# EasyEDA Pro project ProDoc_Board1_2025-01-29.epro

# Schematic Schematic1
Board Name: Board1; Create Date: 2025-01-25; Page Name: P1; Project Name: Pomodorino Timer; Schematic Name: Schematic1; Update Date: 2025-01-27; Company: EasyEDA.com; Page Size: A4; Version: V1.0
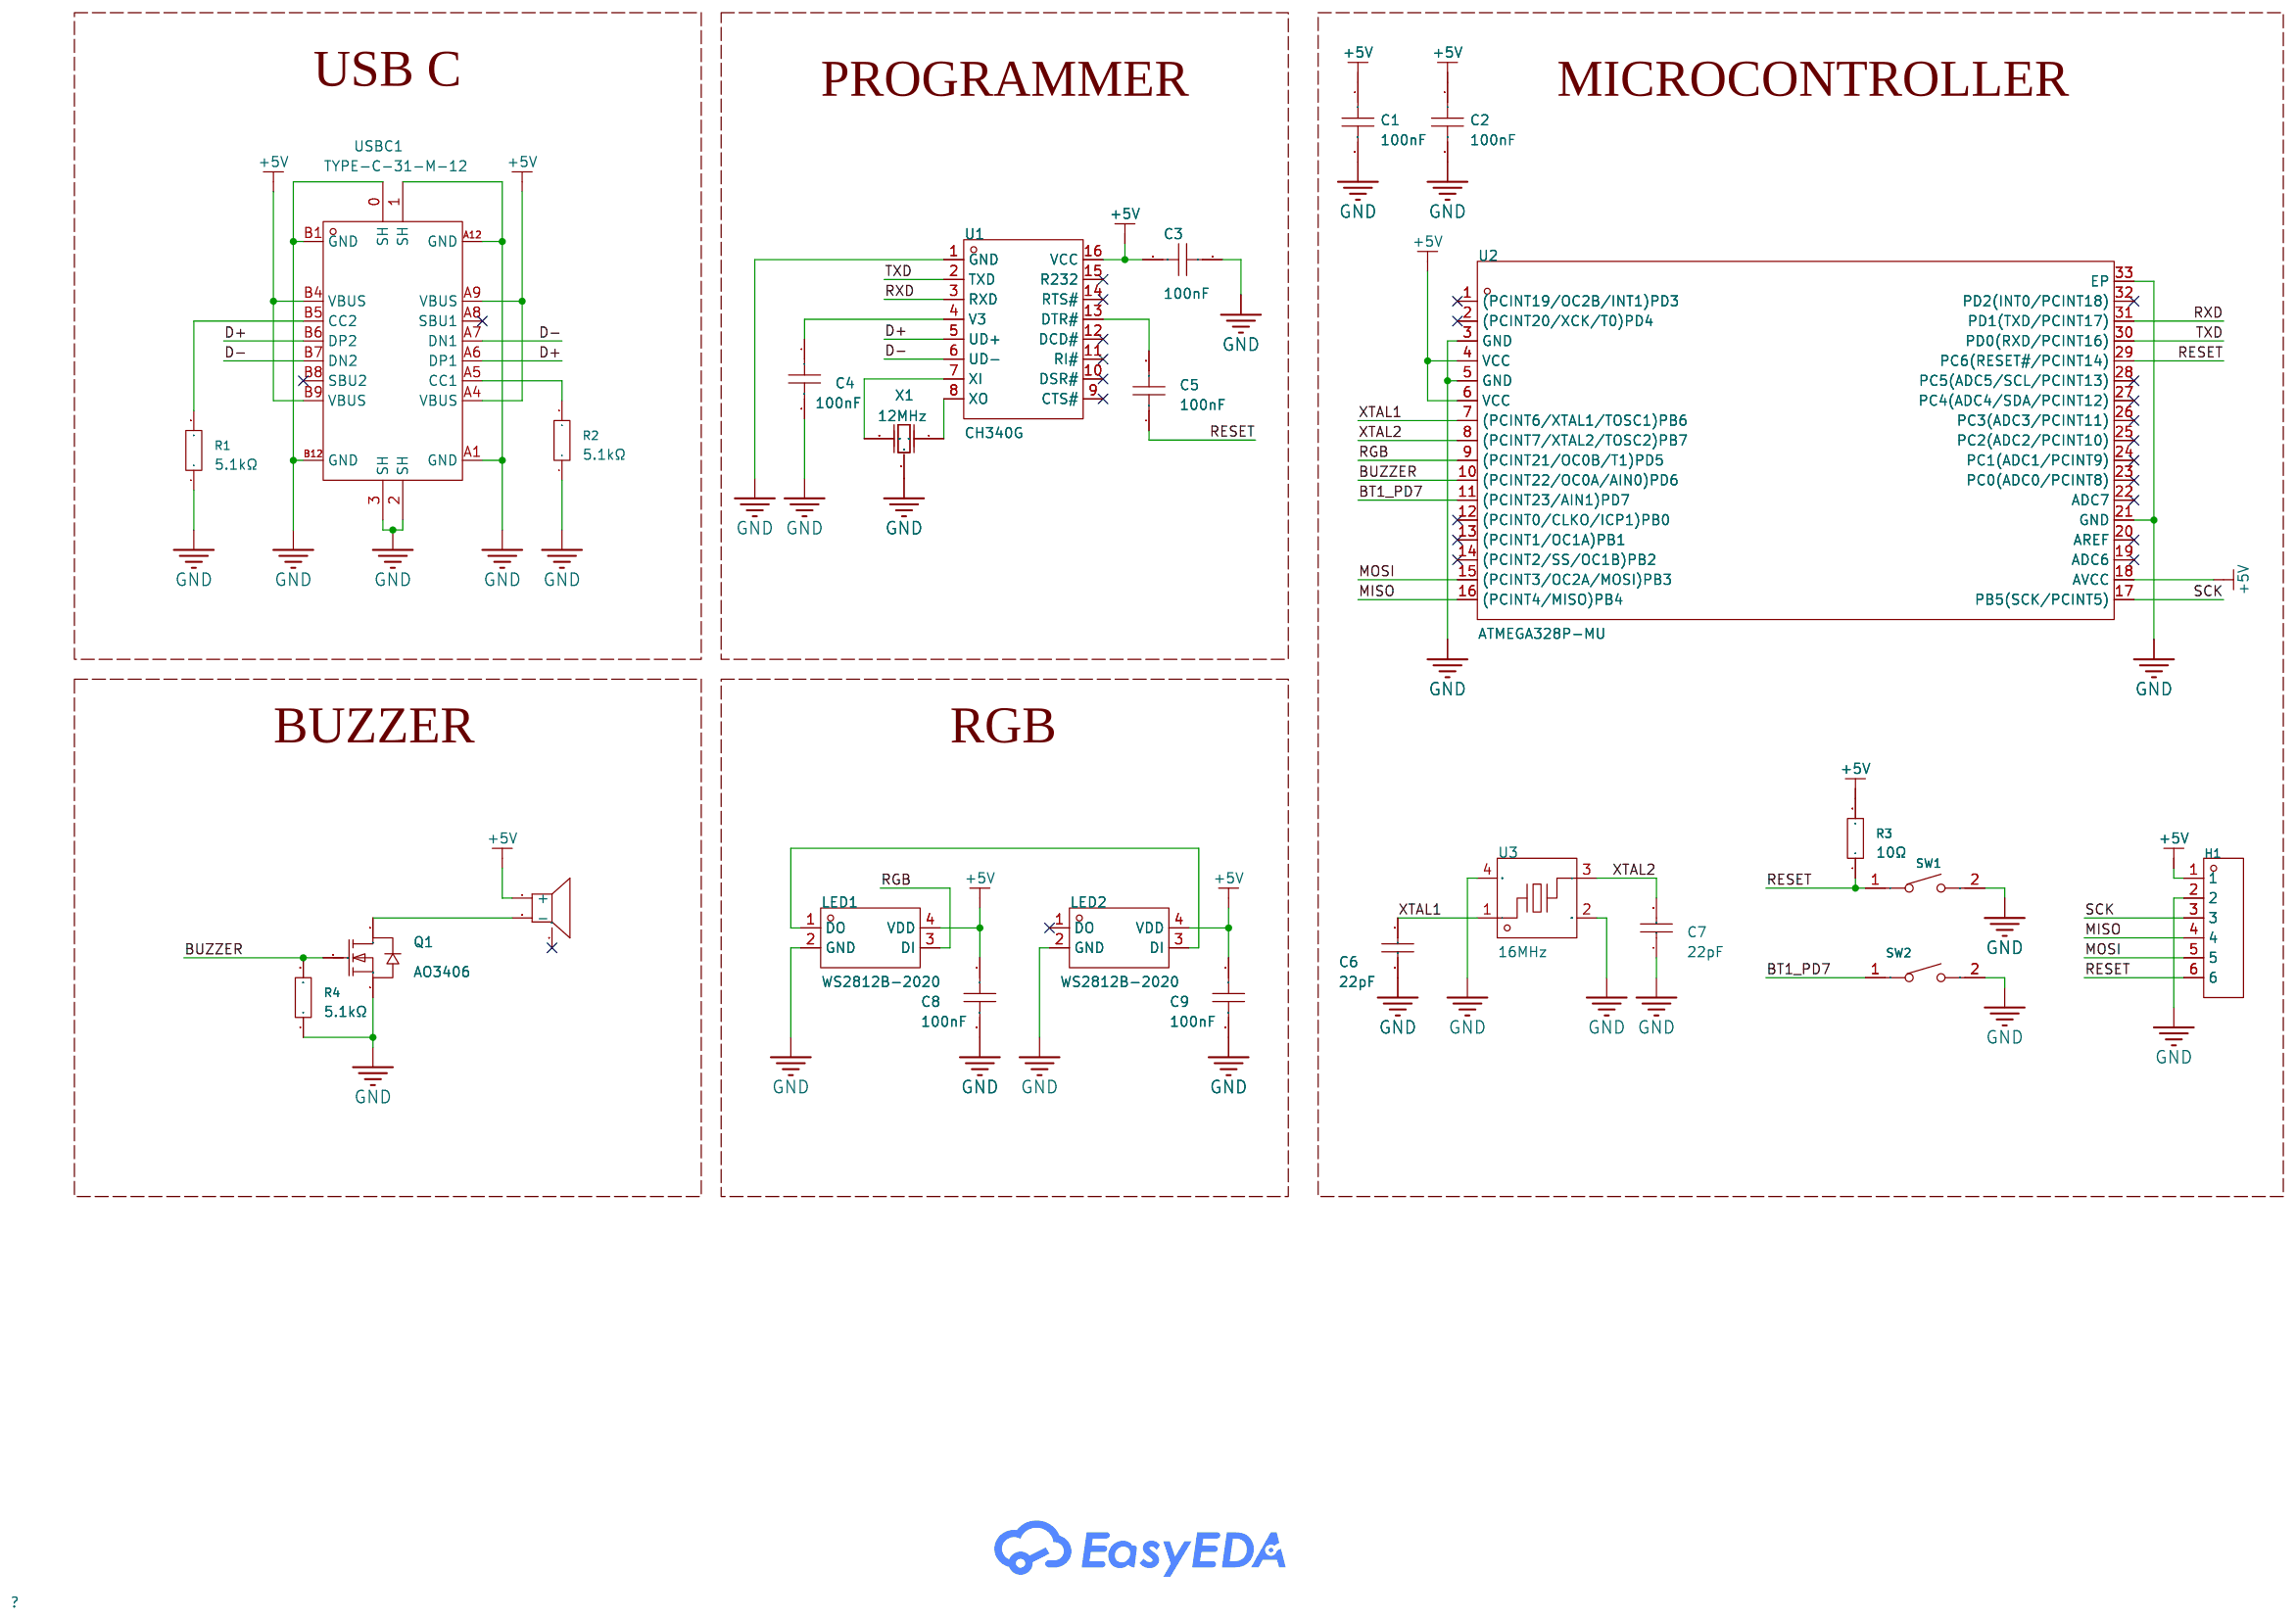
[diagram p0: schematic sheet]

## Parts
BUZZER1  4kHz  [BUZ-SMD_L5.0-W5.5-P4.60]
C1  100nF  [C0402]
C2  100nF  [C0402]
C3  100nF  [C0402]
C4  100nF  [C0402]
C5  100nF  [C0402]
C6  22pF  [C0402]
C7  22pF  [C0402]
C8  100nF  [C0402]
C9  100nF  [C0402]
H1  -  [HDR-TH_6P-P2.54-V-F]
LED1  WS2812B-2020  [LED-SMD_4P-L2.0-W2.0-TL_WS2812B-2020]
LED2  WS2812B-2020  [LED-SMD_4P-L2.0-W2.0-TL_WS2812B-2020]
Q1  AO3406  [SOT-23-3_L2.9-W1.6-P1.90-LS2.8-BR]
R1  5.1kΩ  [R0402]
R2  5.1kΩ  [R0402]
R3  10Ω  [R0402]
R4  5.1kΩ  [R0402]
SW1  TS-1088-AR02016  [SW-SMD_L3.9-W3.0-P4.45]
SW2  TS-1088-AR02016  [SW-SMD_L3.9-W3.0-P4.45]
U1  CH340G  [SOIC-16_L9.9-W3.9-P1.27-LS6.0-BL]
U2  ATMEGA328P-MU  [HVQFN-32_L5.0-W5.0-P0.50-TL-EP3.1]
U3  16MHz  [CRYSTAL-SMD_4P-L3.2-W2.5-BL_SIT8008BI]
USBC1  TYPE-C-31-M-12  [USB-C_SMD-TYPE-C-31-M-12]
X1  12MHz  [CRYSTAL-SMD_3P-L3.2-W1.3-P1.20-L-1]

## Library data of the parts
BUZZER1 = MLT-5020: Driver Circuitry:Passive (external drive) Technology:Electromagnetic Type Frequency:4kHz Length:5.2mm Width:5.2mm Height:2.5mm; Supplier Part: C94598; Manufacturer: 华能; Supplier Footprint: SMD,5x5mm; JLCPCB Part Class: Extended Part; Datasheet: https://atta.szlcsc.com/upload/public/pdf/source/20210811/111454390007D221D7259018FB170E62.pdf; Supplier: LCSC; Driver Circuitry: Passive (external drive); Technology: Electromagnetic Type; Length: 5.2mm; Width: 5.2mm; Height: 2.5mm
C1-C3 C5 C8 C9 = CL05B104KB54PNC: Capacitance: Tolerance:±10% Tolerance:±10% Voltage Rated: Temperature Coefficient:; LCSC Part Name: 100nF ±10% 50V; Supplier Part: C307331; Manufacturer: SAMSUNG(三星); Supplier Footprint: 0402; JLCPCB Part Class: Basic Part; Datasheet: https://atta.szlcsc.com/upload/public/pdf/source/20160218/1457707763339.pdf; Supplier: LCSC; Tolerance: ±10%
C4 = CT41G-0402-2X1-16V-0.1μF-K(N): Capacitance: Tolerance:±10% Tolerance:±10% Voltage Rated: Temperature Coefficient:; LCSC Part Name: 100nF ±10% 16V; Supplier Part: C141382; Manufacturer: TORCH(火炬); Supplier Footprint: 0402; JLCPCB Part Class: Extended Part; Datasheet: https://atta.szlcsc.com/upload/public/pdf/source/20171225/C150708_15141883600121203188.pdf; Supplier: LCSC; Tolerance: ±10%
C6 C7 = 0402CG220J500NT: Capacitance: Tolerance:±5% Tolerance:±5% Voltage Rated: Temperature Coefficient:; LCSC Part Name: 22pF ±5% 50V; Supplier Part: C1555; Manufacturer: FH(风华); Supplier Footprint: 0402; JLCPCB Part Class: Basic Part; Datasheet: https://atta.szlcsc.com/upload/public/pdf/source/20200305/C486355_26A10D38EF8C2A5C37091D0039909270.pdf; Supplier: LCSC; Tolerance: ±5%
H1 = HDR-F_2.54_1x6P: Supplier Footprint: Through
LED1 LED2 = WS2812B-2020: Wavelength:515.6nm；622.5nm；470.4nm Luminous Intensity:- Fixed-Frequency Pwm Mode:- Data Transmission Rate:- Supply Voltage:- Supply Voltage:- Quiescent Dissipation:- Lens Color:-; LCSC Part Name: RGB三色; Supplier Part: C965555; Manufacturer: worldsemi; Supplier Footprint: SMD,2x2mm; JLCPCB Part Class: Extended Part; Datasheet: https://atta.szlcsc.com/upload/public/pdf/source/20241202/DEE3FC25B8AD87F3BB1718ACD77EDECD.pdf; Supplier: LCSC; Wavelength: 515.6nm；622.5nm；470.4nm
Q1 = AO3406_C5379102: Type:1 N-channel Drain Source Voltage (Vdss): Continuous Drain Current (Id): Drain Source On Resistance (RDS(on)@Vgs,Id):35mΩ@10V,3.5A Power Dissipation (Pd):278mW Gate Threshold Voltage (Vgs(th)@Id):1.5V@250uA Total Gate Charge (Qg@Vgs):3.1nC@10V Input C; LCSC Part Name: N沟道,电流:3.5A,耐压:30V; Supplier Part: C5379102; Manufacturer: MSKSEMI(美森科); Supplier Footprint: SOT-23-3L; JLCPCB Part Class: Extended Part; Datasheet: https://atta.szlcsc.com/upload/public/pdf/source/20241113/43B702DEA6BD1B3E76051EAB23BFE352.pdf; Supplier: LCSC; Type: 1 N-channel; Drain Source On Resistance (RDS(on)@Vgs,Id): 35mΩ@10V,3.5A; Power Dissipation (Pd): 278mW; Gate Threshold Voltage (Vgs(th)@Id): 1.5V@250uA; Total Gate Charge (Qg@Vgs): 3.1nC@10V; Input Capacitance (Ciss@Vds): 245pF@25V; Reverse Transfer Capacitance (Crss@Vds): 78pF@25V; Operating Temperature: -50℃~+150℃
R1 R2 R4 = 0402WGF5101TCE: Type:Thick Film Resistors Resistance:5.1kΩ Tolerance:±1% Tolerance:±1% Power(Watts): Overload Voltage (Max): Temperature Coefficient:±100ppm/℃ Temperature Coefficient:±100ppm/℃ Operating Temperature Range:-55℃~+155℃ Operating Temperature Range:-55℃~+155℃; LCSC Part Name: 5.1kΩ ±1% 62.5mW 厚膜电阻; Supplier Part: C25905; Manufacturer: UNI-ROYAL(厚声); Supplier Footprint: 0402; JLCPCB Part Class: Basic Part; Datasheet: https://atta.szlcsc.com/upload/public/pdf/source/20200306/C422600_1E6D84923E4A46A82E41ADD87F860B5C.pdf; Supplier: LCSC; Type: Thick Film Resistors; Tolerance: ±1%; Temperature Coefficient: ±100ppm/℃; Operating Temperature Range: -55℃~+155℃
R3 = 0402WGF100JTCE: Type:Thick Film Resistors Resistance:10Ω Tolerance:±1% Tolerance:±1% Power(Watts): Overload Voltage (Max): Temperature Coefficient:±200ppm/℃ Temperature Coefficient:±200ppm/℃ Operating Temperature Range:-55℃~+155℃ Operating Temperature Range:-55℃~+155℃; LCSC Part Name: 10Ω ±1% 62.5mW 厚膜电阻; Supplier Part: C25077; Manufacturer: UNI-ROYAL(厚声); Supplier Footprint: 0402; JLCPCB Part Class: Basic Part; Datasheet: https://atta.szlcsc.com/upload/public/pdf/source/20200306/C422600_1E6D84923E4A46A82E41ADD87F860B5C.pdf; Supplier: LCSC; Type: Thick Film Resistors; Tolerance: ±1%; Temperature Coefficient: ±200ppm/℃; Operating Temperature Range: -55℃~+155℃
SW1 SW2 = TS-1088-AR02016: Circuit:SPST Actuator Style:Round Button Operating Force:160gf Mounting Style:Brick nogging Switch Length:4mm Switch Width:3mm Switch Height:2mm Strike Gundam:不带 Contact Current:50mA Voltage Rating (DC):12V Insulation Resistance:100MΩ Actuator/Cap Color:B; LCSC Part Name: 4*3*2mm 立贴 轻触开关; Supplier Part: C720477; Manufacturer: XUNPU(讯普); Supplier Footprint: SMD; JLCPCB Part Class: Extended Part; Datasheet: https://atta.szlcsc.com/upload/public/pdf/source/20200810/C720475_60D09DD6C54279ADDB2DC25100F1CC11.pdf; Supplier: LCSC; Circuit: SPST; Actuator Style: Round Button; Operating Force: 160gf; Mounting Style: Brick nogging; Switch Length: 4mm; Switch Width: 3mm; Switch Height: 2mm; Strike Gundam: 不带; Contact Current: 50mA; Voltage Rating (DC): 12V; Insulation Resistance: 100MΩ; Actuator/Cap Color: Black; Pin Style: SMDSplicing; Mechanical Life: 10万次; Operating Temperature: -30℃~+80℃
U1 = CH340G: Applications Function:USB to UART Protocol: Supply Voltage:5V；3.3V Supply Voltage:5V；3.3V Data Rate:2Mbps Operating Temperature:-40℃~+85℃ Operating Temperature:-40℃~+85℃; LCSC Part Name: USB转串口芯片CH340; Supplier Part: C14267; Manufacturer: WCH(南京沁恒); Supplier Footprint: SOP-16; JLCPCB Part Class: Extended Part; Datasheet: https://atta.szlcsc.com/upload/public/pdf/source/20240313/8510303D24D987FBF1AD30058571F10E.pdf; Supplier: LCSC; Applications Function: USB to UART; Supply Voltage: 5V；3.3V; Data Rate: 2Mbps; Operating Temperature: -40℃~+85℃
U2 = ATMEGA328P-MU_C7499261: CPU Core:AVR CPU Maximum Speed:20MHz Number of I/O:23 ADC (Bit):10bit Voltage - Supply:1.8V~5.5V Voltage - Supply:1.8V~5.5V Applications:-; Supplier Part: C7499261; Manufacturer: MICROCHIP(美国微芯); Supplier Footprint: VQFN-32(5x5); JLCPCB Part Class: Extended Part; Datasheet: https://atta.szlcsc.com/upload/public/pdf/source/20230908/85D6DA5391498C20E7706F0832EC6BD4.pdf; Supplier: LCSC; CPU Core: AVR; CPU Maximum Speed: 20MHz; Number of I/O: 23; ADC (Bit): 10bit; Voltage - Supply: 1.8V~5.5V
U3 = S3216000222080C3: Crystal Type:Surface Mount Crystal Frequency:16MHz Normal temperature Frequency Tolerance:±30ppm Normal temperature Frequency Tolerance:±30ppm External load capacitor: Frequency Stability(Full temperature range):±20ppm Frequency Stability(Full temperature; LCSC Part Name: 16MHz ±30ppm 22pF; Supplier Part: C5380579; Manufacturer: JGHC(晶光华); Supplier Footprint: SMD3225-4P; JLCPCB Part Class: Extended Part; Datasheet: https://atta.szlcsc.com/upload/public/pdf/source/20230330/7100B151BC7AD673488A192D86CE4D0A.pdf; Supplier: LCSC; Crystal Type: Surface Mount Crystal; Normal temperature Frequency Tolerance: ±30ppm; Frequency Stability(Full temperature range): ±20ppm; Equivalent Series Resistance (ESR): 80Ω
USBC1 = TYPE-C-31-M-12: Connector Type:Type-C Standard:- Gender:Female Mounting Style:- Number of Contacts:16P Number of Ports:1 Current Rating - Power (Max):5A Operating Temperature Range:- Operating Temperature Range:-; LCSC Part Name: Type-C 母; Supplier Part: C165948; Manufacturer: 韩国韩荣; Supplier Footprint: SMD; JLCPCB Part Class: Extended Part; Datasheet: https://atta.szlcsc.com/upload/public/pdf/source/20220525/466408E853115E789EDB0DDC29077C05.pdf; Supplier: LCSC; Connector Type: Type-C; Gender: Female; Number of Contacts: 16P; Number of Ports: 1; Current Rating - Power (Max): 5A
X1 = CSTNE12M0G550000R0: Frequency: Built-in Load Capacitance: Resonant Impedance: Operating Temperature:-40℃~+85℃ Operating Temperature:-40℃~+85℃; LCSC Part Name: 12MHz ±0.5% 内置负载电容:33pF; Supplier Part: C341520; Manufacturer: muRata(村田); Supplier Footprint: SMD3213-3P; JLCPCB Part Class: Extended Part; Datasheet: https://atta.szlcsc.com/upload/public/pdf/source/20181211/C341520_3A24A4BE67322B2B0F578277F73E32C0.pdf; Supplier: LCSC; Operating Temperature: -40℃~+85℃

## Nets
+5V: BUZZER1.1(+) C1.1 C2.1 C3.2 C8.1 C9.1 H1.1 LED1.4(VDD) LED2.4(VDD) R3.2 U1.16(VCC) U2.4(VCC) U2.6(VCC) U2.18(AVCC) USBC1.A4(VBUS) USBC1.A9(VBUS) USBC1.B4(VBUS) USBC1.B9(VBUS)
GND: C1.2 C2.2 C3.1 C4.2 C6.1 C7.1 C8.2 C9.2 H1.2 LED1.2(GND) LED2.2(GND) Q1.2(S) R1.1 R2.1 R4.1 SW1.2 SW2.2 U1.1(GND) U2.3(GND) U2.5(GND) U2.21(GND) U2.33(EP) U3.2(GND) U3.4(GND) USBC1.0(SH) USBC1.1(SH) USBC1.2(SH) USBC1.3(SH) USBC1.A1(GND) USBC1.A12(GND) USBC1.B1(GND) USBC1.B12(GND) X1.2(GND)
BT1_PD7: SW2.1 U2.11((PCINT23/AIN1)PD7)
BUZZER: Q1.1(G) R4.2 U2.10((PCINT22/OC0A/AIN0)PD6)
D+: U1.5(UD+) USBC1.A6(DP1) USBC1.B6(DP2)
D-: U1.6(UD-) USBC1.A7(DN1) USBC1.B7(DN2)
MISO: H1.4 U2.16((PCINT4/MISO)PB4)
MOSI: H1.5 U2.15((PCINT3/OC2A/MOSI)PB3)
RESET: C5.1 H1.6 R3.1 SW1.1 U2.29(PC6(RESET#/PCINT14))
RGB: LED1.3(DI) U2.9((PCINT21/OC0B/T1)PD5)
RXD: U1.3(RXD) U2.31(PD1(TXD/PCINT17))
SCK: H1.3 U2.17(PB5(SCK/PCINT5))
TXD: U1.2(TXD) U2.30(PD0(RXD/PCINT16))
XTAL1: C6.2 U2.7((PCINT6/XTAL1/TOSC1)PB6) U3.1
XTAL2: C7.2 U2.8((PCINT7/XTAL2/TOSC2)PB7) U3.3
$1N1307: R1.2 USBC1.B5(CC2)
$1N1311: R2.2 USBC1.A5(CC1)
$1N1921: C5.2 U1.13(DTR#)
$1N2036: C4.1 U1.4(V3)
$1N3700: BUZZER1.2(-) Q1.3(D)
$1N4772: U1.8(XO) X1.1(INPUT)
$1N4777: U1.7(XI) X1.3(OUTPUT)
$1N5829: LED1.1(DO) LED2.3(DI)

Not connected (* = marked no-connect by the designer): BUZZER1 3(NC)*; LED2 1(DO)*; U1 9(CTS#)* 10(DSR#)* 11(RI#)* 12(DCD#)* 14(RTS#)* 15(R232)*; U2 1((PCINT19/OC2B/INT1)PD3)* 2((PCINT20/XCK/T0)PD4)* 12((PCINT0/CLKO/ICP1)PB0)* 13((PCINT1/OC1A)PB1)* 14((PCINT2/SS/OC1B)PB2)* 19(ADC6)* 20(AREF)* 22(ADC7)* 23(PC0(ADC0/PCINT8))* 24(PC1(ADC1/PCINT9))* 25(PC2(ADC2/PCINT10))* 26(PC3(ADC3/PCINT11))* 27(PC4(ADC4/SDA/PCINT12))* 28(PC5(ADC5/SCL/PCINT13))* 32(PD2(INT0/PCINT18))*; USBC1 A8(SBU1)* B8(SBU2)*

## Notes on the sheet
- USB C
- PROGRAMMER
- MICROCONTROLLER
- BUZZER
- RGB

# Board PCB1
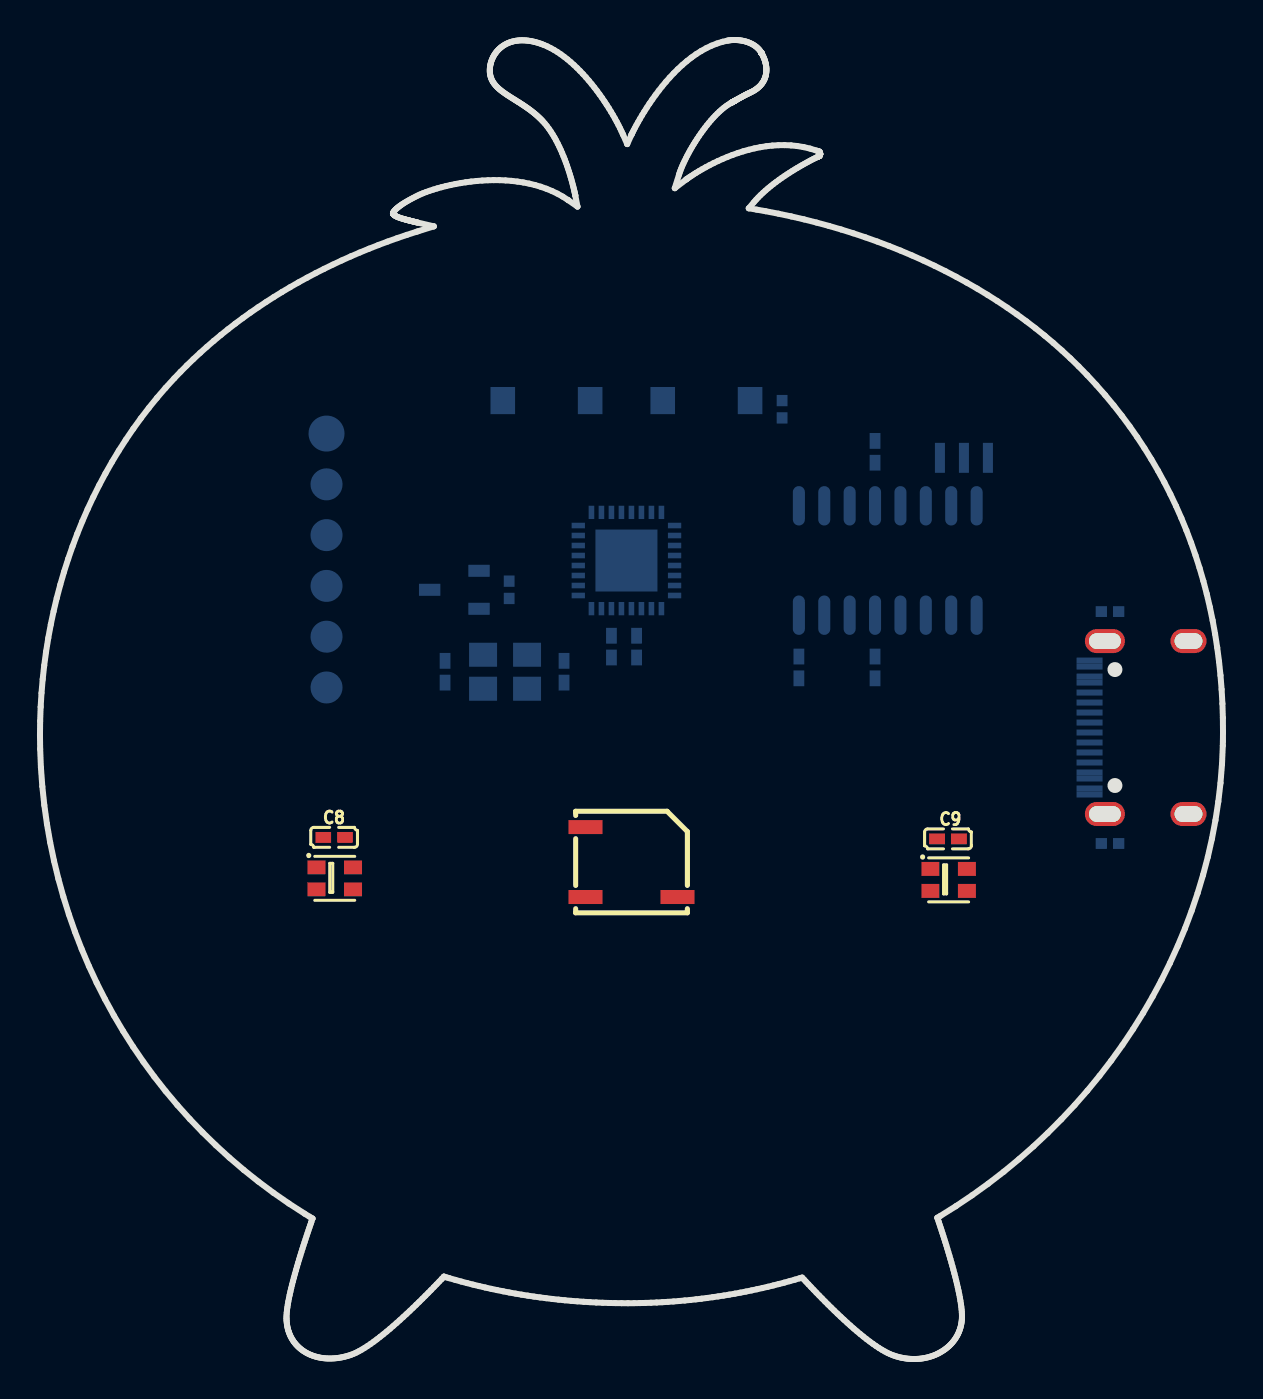
[diagram p1: board, top side]
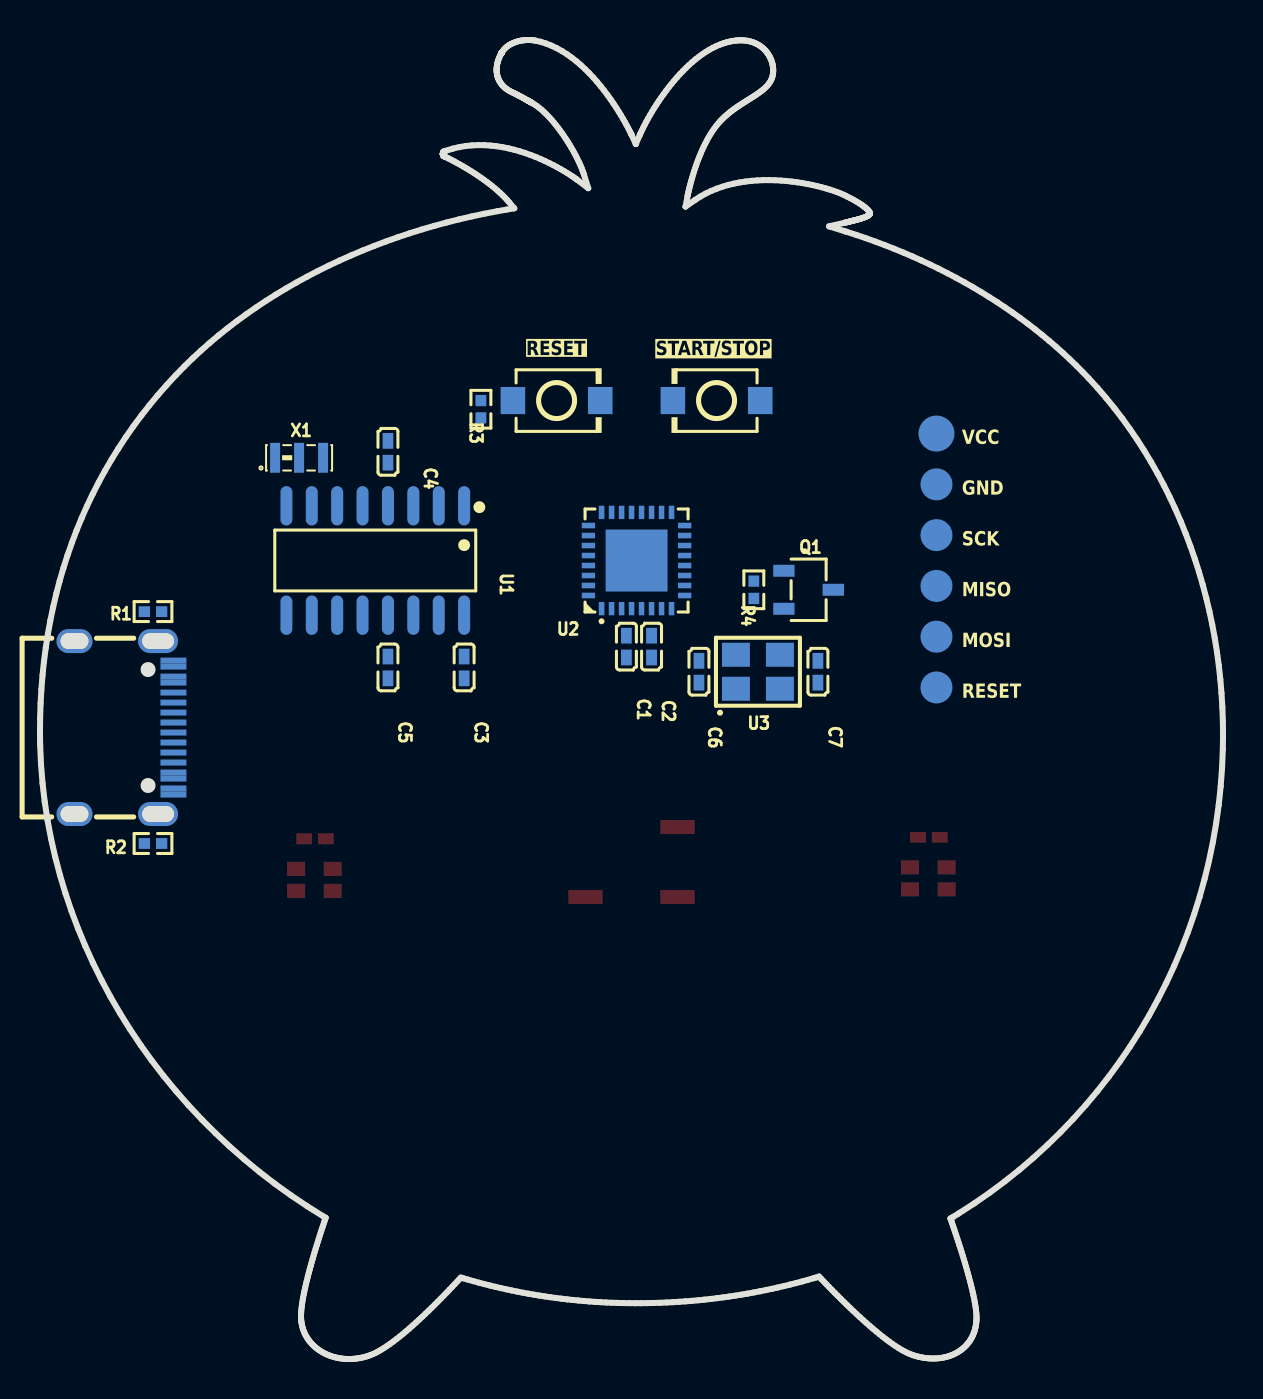
[diagram p2: board, bottom side, seen from below]

Outline 59.17 x 65.98 mm; copper layers: Top Layer, Bottom Layer. Coordinates in mm from the lower left corner of the outline.
Outline path: 0,31.21 0.01,30.51 0.05,29.59 0.12,28.64 0.22,27.7 0.35,26.77 0.51,25.84 0.7,24.93 0.92,24.02 1.17,23.12 1.45,22.24 1.75,21.36 2.09,20.5 2.45,19.66 2.83,18.82 3.25,18 3.69,17.19 4.16,16.4 4.65,15.62 5.17,14.87 5.71,14.12 6.28,13.4 6.87,12.69 7.49,12.01 8.13,11.34 8.79,10.69 9.48,10.07 10.19,9.46 10.92,8.88 11.67,8.32 12.45,7.78 13.24,7.27 13.48,7.12 13.63,7.03 13.57,6.86 13.56,6.81 13.52,6.7 13.48,6.58 13.43,6.44 13.38,6.3 13.34,6.16 13.28,6 13.23,5.84 13.18,5.68 13.13,5.51 13.07,5.34 13.02,5.16 12.96,4.98 12.91,4.8 12.85,4.62 12.8,4.44 12.75,4.26 12.7,4.07 12.65,3.89 12.61,3.72 12.56,3.54 12.52,3.37 12.49,3.2 12.45,3.04 12.42,2.88 12.4,2.73 12.37,2.58 12.35,2.44 12.34,2.31 12.33,2.19 12.33,2.09 12.33,2.02 12.33,1.95 12.34,1.88 12.34,1.81 12.35,1.75 12.36,1.68 12.37,1.62 12.39,1.56 12.4,1.49 12.42,1.43 12.44,1.37 12.46,1.31 12.48,1.25 12.51,1.19 12.53,1.14 12.56,1.08 12.59,1.03 12.62,0.97 12.66,0.92 12.69,0.87 12.73,0.82 12.77,0.77 12.81,0.73 12.85,0.68 12.89,0.63 12.94,0.59 12.98,0.55 13.03,0.51 13.08,0.47 13.13,0.43 13.2,0.39 13.26,0.35 13.33,0.31 13.4,0.27 13.47,0.24 13.54,0.21 13.62,0.18 13.69,0.15 13.77,0.13 13.85,0.1 13.93,0.09 14.01,0.07 14.09,0.06 14.17,0.04 14.25,0.04 14.34,0.03 14.42,0.03 14.51,0.03 14.59,0.03 14.68,0.03 14.77,0.04 14.86,0.05 14.94,0.06 15.03,0.07 15.12,0.09 15.21,0.11 15.3,0.13 15.39,0.16 15.48,0.18 15.57,0.21 15.69,0.26 15.82,0.32 15.95,0.39 16.09,0.47 16.23,0.55 16.38,0.65 16.53,0.75 16.69,0.86 16.85,0.98 17.01,1.11 17.17,1.24 17.34,1.37 17.5,1.51 17.67,1.65 17.83,1.8 18,1.95 18.16,2.1 18.33,2.25 18.49,2.4 18.65,2.56 18.81,2.71 18.97,2.86 19.12,3.02 19.28,3.16 19.42,3.31 19.56,3.46 19.7,3.6 19.84,3.74 19.96,3.87 20.08,3.99 20.21,4.12 20.34,4.08 20.47,4.04 20.77,3.96 21.07,3.88 21.36,3.8 21.66,3.72 21.96,3.65 22.26,3.58 22.56,3.51 22.87,3.45 23.17,3.39 23.47,3.33 23.78,3.27 24.09,3.22 24.39,3.17 24.7,3.12 25.01,3.08 25.32,3.04 25.63,3 25.94,2.97 26.25,2.94 26.57,2.91 26.88,2.88 27.19,2.86 27.51,2.84 27.82,2.83 28.14,2.81 28.46,2.8 28.77,2.8 29.09,2.79 29.41,2.79 29.72,2.79 30,2.8 30.28,2.81 30.56,2.81 30.85,2.83 31.13,2.84 31.41,2.86 31.69,2.88 31.97,2.9 32.25,2.93 32.53,2.95 32.81,2.99 33.09,3.02 33.37,3.05 33.65,3.09 33.93,3.13 34.2,3.18 34.48,3.22 34.76,3.27 35.03,3.32 35.31,3.37 35.58,3.43 35.86,3.49 36.13,3.55 36.4,3.61 36.68,3.68 36.95,3.75 37.22,3.82 37.49,3.89 37.76,3.97 37.99,4.04 38.12,4.08 38.22,3.97 38.31,3.87 38.43,3.74 38.56,3.6 38.69,3.47 38.83,3.32 38.97,3.18 39.12,3.03 39.26,2.88 39.42,2.73 39.57,2.57 39.73,2.42 39.89,2.27 40.05,2.12 40.21,1.97 40.37,1.82 40.53,1.67 40.7,1.53 40.86,1.39 41.02,1.25 41.18,1.12 41.34,1 41.5,0.88 41.66,0.76 41.81,0.66 41.96,0.56 42.1,0.47 42.24,0.38 42.38,0.31 42.51,0.25 42.64,0.2 42.74,0.16 42.83,0.13 42.92,0.11 43.01,0.08 43.1,0.06 43.2,0.05 43.29,0.03 43.38,0.02 43.47,0.01 43.56,0 43.65,0 43.74,0 43.83,0 43.92,0.01 44.01,0.01 44.09,0.02 44.18,0.04 44.27,0.05 44.35,0.07 44.44,0.09 44.52,0.12 44.6,0.14 44.68,0.17 44.76,0.2 44.84,0.24 44.92,0.27 45,0.31 45.07,0.36 45.14,0.4 45.22,0.45 45.28,0.49 45.33,0.54 45.39,0.58 45.44,0.62 45.49,0.67 45.53,0.72 45.58,0.76 45.62,0.81 45.67,0.86 45.71,0.91 45.75,0.97 45.78,1.02 45.82,1.07 45.85,1.13 45.88,1.19 45.91,1.24 45.94,1.3 45.96,1.36 45.99,1.42 46.01,1.48 46.03,1.54 46.05,1.61 46.06,1.67 46.08,1.73 46.09,1.8 46.1,1.86 46.1,1.93 46.11,2 46.11,2.06 46.11,2.13 46.11,2.22 46.11,2.34 46.1,2.48 46.08,2.62 46.06,2.76 46.04,2.92 46.01,3.07 45.98,3.24 45.94,3.41 45.91,3.58 45.87,3.75 45.82,3.93 45.78,4.11 45.73,4.29 45.69,4.47 45.64,4.65 45.59,4.82 45.54,5 45.48,5.18 45.43,5.35 45.38,5.52 45.33,5.69 45.28,5.85 45.23,6.01 45.18,6.16 45.13,6.31 45.09,6.44 45.05,6.58 45.01,6.7 44.97,6.81 44.94,6.89 44.88,7.07 45.04,7.16 45.81,7.64 46.63,8.19 47.43,8.77 48.21,9.37 48.96,9.99 49.69,10.64 50.4,11.3 51.09,11.99 51.75,12.7 52.38,13.42 52.99,14.16 53.58,14.92 54.13,15.7 54.67,16.49 55.17,17.3 55.65,18.12 56.1,18.96 56.52,19.8 56.91,20.66 57.27,21.53 57.6,22.42 57.9,23.31 58.17,24.21 58.41,25.11 58.62,26.03 58.79,26.95 58.94,27.88 59.04,28.81 59.12,29.74 59.16,30.68 59.17,30.91 59.17,31.35 59.16,32.07 59.14,32.79 59.1,33.49 59.04,34.2 58.97,34.89 58.88,35.58 58.78,36.26 58.65,36.94 58.51,37.61 58.36,38.27 58.19,38.92 58,39.56 57.79,40.2 57.57,40.83 57.34,41.45 57.09,42.07 56.82,42.67 56.53,43.27 56.24,43.85 55.92,44.43 55.59,45 55.24,45.56 54.88,46.11 54.5,46.65 54.11,47.18 53.7,47.7 53.28,48.22 52.84,48.72 52.38,49.21 51.95,49.66 51.54,50.05 51.12,50.44 50.69,50.82 50.25,51.19 49.8,51.55 49.34,51.91 48.86,52.25 48.38,52.59 47.89,52.92 47.38,53.24 46.87,53.55 46.35,53.85 45.82,54.14 45.28,54.42 44.73,54.69 44.18,54.95 43.61,55.2 43.04,55.44 42.46,55.68 41.87,55.9 41.28,56.11 40.68,56.31 40.07,56.5 39.46,56.68 38.84,56.85 38.21,57.01 37.58,57.15 36.94,57.29 36.3,57.41 35.84,57.49 35.45,57.56 35.71,57.86 35.81,57.98 35.92,58.1 36.04,58.22 36.16,58.33 36.28,58.44 36.41,58.55 36.54,58.66 36.68,58.77 36.81,58.87 36.95,58.97 37.08,59.07 37.22,59.16 37.35,59.25 37.49,59.34 37.62,59.42 37.75,59.5 37.87,59.58 37.99,59.65 38.11,59.72 38.22,59.78 38.33,59.84 38.43,59.89 38.52,59.94 38.61,59.99 38.69,60.03 38.76,60.06 38.82,60.09 38.94,60.15 38.97,60.17 38.99,60.19 39,60.21 39.01,60.23 39.02,60.25 39.02,60.27 39.02,60.29 39.02,60.32 39.01,60.33 39,60.36 38.99,60.38 38.98,60.39 38.96,60.4 38.95,60.41 38.83,60.45 38.52,60.55 38.2,60.62 37.88,60.67 37.57,60.71 37.25,60.72 36.94,60.72 36.63,60.7 36.33,60.66 36.03,60.62 35.73,60.56 35.45,60.49 35.17,60.41 34.9,60.32 34.63,60.23 34.38,60.13 34.14,60.03 33.91,59.92 33.69,59.82 33.49,59.71 33.29,59.61 33.12,59.51 32.96,59.42 32.81,59.33 32.68,59.25 32.57,59.18 32.48,59.11 32.41,59.06 32.35,59.03 32.31,59 31.75,58.57 31.75,58.57 31.96,59.24 31.99,59.34 32.03,59.45 32.08,59.56 32.13,59.68 32.18,59.81 32.24,59.94 32.31,60.07 32.38,60.2 32.45,60.34 32.53,60.48 32.61,60.61 32.69,60.75 32.78,60.89 32.87,61.03 32.96,61.17 33.06,61.31 33.15,61.45 33.25,61.58 33.35,61.71 33.46,61.84 33.56,61.96 33.67,62.08 33.77,62.19 33.88,62.3 33.99,62.4 34.1,62.5 34.21,62.59 34.31,62.67 34.42,62.75 34.53,62.81 34.57,62.83 34.63,62.87 34.67,62.89 34.71,62.91 34.79,62.96 34.86,63 34.91,63.03 34.98,63.06 35.01,63.08 35.05,63.1 35.1,63.13 35.12,63.14 35.19,63.18 35.24,63.21 35.27,63.22 35.29,63.23 35.31,63.25 35.34,63.26 35.39,63.28 35.43,63.31 35.47,63.32 35.54,63.35 35.57,63.37 35.61,63.39 35.65,63.41 35.68,63.43 35.72,63.45 35.75,63.47 35.79,63.49 35.82,63.52 35.85,63.54 35.88,63.56 35.91,63.59 35.94,63.61 35.96,63.64 35.99,63.66 36.02,63.69 36.04,63.71 36.06,63.74 36.09,63.77 36.11,63.79 36.13,63.82 36.15,63.85 36.17,63.88 36.18,63.91 36.2,63.94 36.22,63.97 36.23,64 36.24,64.04 36.26,64.07 36.27,64.1 36.28,64.13 36.29,64.17 36.3,64.21 36.31,64.25 36.32,64.28 36.32,64.32 36.33,64.36 36.33,64.4 36.33,64.44 36.33,64.48 36.33,64.51 36.33,64.55 36.33,64.59 36.32,64.63 36.32,64.67 36.31,64.72 36.31,64.76 36.3,64.8 36.29,64.84 36.28,64.88 36.27,64.92 36.25,64.96 36.24,65 36.22,65.04 36.21,65.08 36.19,65.12 36.17,65.17 36.15,65.21 36.13,65.25 36.11,65.29 36.08,65.33 36.07,65.36 36.07,65.36 36.03,65.41 36,65.46 35.96,65.51 35.92,65.55 35.87,65.6 35.83,65.64 35.78,65.67 35.73,65.71 35.67,65.74 35.62,65.77 35.56,65.8 35.5,65.83 35.45,65.85 35.38,65.88 35.32,65.89 35.26,65.91 35.2,65.93 35.13,65.94 35.07,65.95 35.01,65.96 34.94,65.97 34.88,65.97 34.81,65.98 34.75,65.98 34.69,65.98 34.62,65.98 34.56,65.97 34.5,65.96 34.44,65.96 34.38,65.95 34.14,65.89 33.86,65.8 33.59,65.7 33.33,65.57 33.07,65.43 32.82,65.27 32.58,65.1 32.35,64.92 32.12,64.73 31.91,64.52 31.7,64.31 31.5,64.1 31.31,63.88 31.12,63.66 30.95,63.44 30.78,63.23 30.63,63.01 30.49,62.8 30.35,62.59 30.23,62.4 30.11,62.21 30.01,62.03 29.91,61.87 29.83,61.72 29.76,61.59 29.7,61.48 29.65,61.38 29.62,61.31 29.58,61.23 29.58,61.23 29.37,60.77 29.37,60.77 29.17,61.23 29.15,61.28 29.08,61.43 29.01,61.58 28.93,61.73 28.84,61.89 28.75,62.06 28.66,62.22 28.56,62.39 28.45,62.56 28.34,62.74 28.23,62.91 28.11,63.09 27.99,63.26 27.86,63.44 27.73,63.61 27.59,63.78 27.45,63.95 27.31,64.11 27.16,64.27 27.01,64.43 26.86,64.58 26.7,64.73 26.54,64.88 26.38,65.01 26.22,65.14 26.05,65.26 25.88,65.37 25.71,65.48 25.54,65.57 25.37,65.66 25.21,65.73 25.13,65.76 25.05,65.79 24.97,65.82 24.89,65.84 24.81,65.87 24.73,65.89 24.65,65.9 24.58,65.92 24.5,65.93 24.43,65.94 24.35,65.95 24.28,65.96 24.2,65.96 24.13,65.96 24.06,65.96 23.99,65.96 23.92,65.95 23.86,65.95 23.79,65.94 23.72,65.92 23.66,65.91 23.6,65.89 23.53,65.87 23.47,65.85 23.41,65.83 23.35,65.8 23.3,65.77 23.24,65.74 23.19,65.7 23.13,65.67 23.09,65.64 23.05,65.61 23.02,65.58 22.98,65.54 22.94,65.51 22.91,65.47 22.87,65.43 22.84,65.4 22.81,65.36 22.78,65.32 22.75,65.28 22.73,65.24 22.7,65.19 22.68,65.15 22.65,65.11 22.63,65.06 22.61,65.02 22.59,64.97 22.58,64.92 22.56,64.88 22.55,64.83 22.54,64.78 22.53,64.73 22.52,64.69 22.51,64.64 22.5,64.59 22.5,64.54 22.5,64.49 22.5,64.44 22.5,64.39 22.5,64.33 22.51,64.27 22.52,64.21 22.54,64.15 22.55,64.1 22.57,64.04 22.6,63.99 22.62,63.94 22.65,63.89 22.68,63.84 22.71,63.8 22.75,63.75 22.79,63.7 22.83,63.66 22.87,63.62 22.92,63.57 22.96,63.53 23.01,63.49 23.06,63.45 23.12,63.41 23.17,63.37 23.23,63.33 23.28,63.29 23.34,63.25 23.4,63.21 23.47,63.17 23.59,63.08 23.66,63.04 23.8,62.95 23.87,62.91 23.94,62.86 24.02,62.82 24.11,62.76 24.21,62.69 24.26,62.66 24.36,62.59 24.41,62.56 24.45,62.52 24.5,62.48 24.55,62.45 24.6,62.41 24.65,62.37 24.7,62.33 24.75,62.3 24.79,62.25 24.84,62.21 24.89,62.17 24.94,62.13 24.98,62.08 25.03,62.04 25.07,61.99 25.12,61.95 25.16,61.9 25.24,61.81 25.35,61.68 25.45,61.55 25.55,61.4 25.64,61.26 25.73,61.11 25.82,60.95 25.9,60.8 25.97,60.64 26.05,60.48 26.12,60.32 26.18,60.16 26.25,60 26.3,59.85 26.36,59.69 26.41,59.54 26.46,59.4 26.5,59.25 26.54,59.12 26.58,58.99 26.62,58.86 26.65,58.75 26.67,58.64 26.7,58.55 26.72,58.46 26.74,58.38 26.75,58.32 26.77,58.22 26.78,58.19 26.88,57.65 26.43,57.96 26.4,57.98 26.14,58.15 25.88,58.29 25.61,58.42 25.33,58.54 25.04,58.64 24.76,58.72 24.47,58.79 24.17,58.85 23.88,58.9 23.58,58.93 23.29,58.95 22.99,58.97 22.7,58.97 22.41,58.96 22.12,58.95 21.84,58.93 21.56,58.9 21.3,58.86 21.03,58.82 20.78,58.77 20.54,58.72 20.3,58.67 20.08,58.61 19.87,58.55 19.67,58.49 19.48,58.43 19.31,58.37 19.16,58.31 19.02,58.25 18.89,58.2 18.78,58.14 18.66,58.08 18.56,58.02 18.46,57.97 18.37,57.92 18.29,57.87 18.21,57.82 18.14,57.78 18.08,57.74 18.02,57.7 17.97,57.66 17.92,57.62 17.88,57.59 17.84,57.55 17.81,57.52 17.78,57.49 17.75,57.47 17.73,57.44 17.72,57.42 17.7,57.4 17.69,57.38 17.68,57.36 17.66,57.34 17.66,57.31 17.66,57.29 17.66,57.28 17.67,57.27 17.69,57.25 17.71,57.23 17.73,57.21 17.76,57.19 17.78,57.18 17.8,57.17 17.82,57.16 17.87,57.13 17.9,57.12 17.93,57.11 17.96,57.1 18,57.08 18.03,57.07 18.07,57.06 18.12,57.05 18.18,57.03 18.22,57.02 18.27,57 18.34,56.98 18.38,56.97 18.5,56.94 18.59,56.92 18.67,56.9 18.69,56.89 18.77,56.87 18.8,56.87 18.84,56.86 18.88,56.85 18.9,56.84 19.7,56.66 18.91,56.41 18.83,56.38 18.34,56.23 17.87,56.07 17.39,55.9 16.92,55.72 16.46,55.54 16,55.35 15.54,55.15 15.09,54.95 14.65,54.75 14.21,54.53 13.78,54.31 13.35,54.09 12.93,53.85 12.51,53.62 12.1,53.37 11.7,53.12 11.3,52.87 10.91,52.61 10.52,52.34 10.14,52.07 9.77,51.79 9.4,51.51 9.04,51.22 8.69,50.93 8.34,50.63 8,50.32 7.67,50.01 7.35,49.7 7.03,49.38 6.72,49.05 6.28,48.57 5.85,48.08 5.44,47.57 5.05,47.06 4.66,46.53 4.29,45.98 3.94,45.43 3.6,44.87 3.27,44.3 2.96,43.71 2.67,43.12 2.38,42.52 2.12,41.9 1.87,41.28 1.63,40.65 1.41,40.02 1.2,39.37 1.01,38.72 0.84,38.07 0.68,37.4 0.54,36.73 0.41,36.06 0.3,35.38 0.21,34.69 0.14,34.01 0.08,33.31 0.03,32.62 0.01,31.92 0,31.21
Stack: Top Layer 0.035mm / Dielectric1 1.51mm FR4 er 4.5 / Bottom Layer 0.035mm

## Design rules (mm)
template: Custom Config
spacing copperThickness1oz (default): track to track 0.2, other pairs 0.152 to 0.3
spacing copperThickness2oz: track to track 0.203, other pairs 0.152 to 0.3
track width copperThickness1oz (default): min 0.127, default 0.2, max 2.54
track width copperThickness2oz: min 0.203, default 0.254, max 2.54
differential pair differentialPair (default): width min 0.127, default 0.254, max 2.54; gap min 0.152, default 0.152
via viaSize (default): diameter min 0.5, default 0.6, max 10; hole min 0.3, default 0.3, max 6.3

## Placement (name value [footprint] x y rotation side)
BUZZER1  4kHz  [BUZ-SMD_L5.0-W5.5-P4.60]  29.59 24.86 0 top
C1  100nF  [C0402]  29.84 35.63 270 bottom
C2  100nF  [C0402]  28.58 35.63 270 bottom
C3  100nF  [C0402]  37.96 34.59 90 bottom
C4  100nF  [C0402]  41.77 45.38 90 bottom
C5  100nF  [C0402]  41.77 34.59 90 bottom
C6  22pF  [C0402]  26.21 34.38 270 bottom
C7  22pF  [C0402]  20.26 34.38 90 bottom
C8  100nF  [C0402]  14.71 26.09 180 top
C9  100nF  [C0402]  45.41 26.02 180 top
H1  -  [HDR-TH_6P-P2.54-V-F]  14.33 39.94 270 bottom
LED1  WS2812B-2020  [LED-SMD_4P-L2.0-W2.0-TL_WS2812B-2020]  14.74 24.04 0 top
LED2  WS2812B-2020  [LED-SMD_4P-L2.0-W2.0-TL_WS2812B-2020]  45.45 23.97 0 top
Q1  AO3406  [SOT-23-3_L2.9-W1.6-P1.90-LS2.8-BR]  20.73 38.48 0 bottom
R1  5.1kΩ  [R0402]  53.52 37.39 0 bottom
R2  5.1kΩ  [R0402]  53.52 25.79 0 bottom
R3  10Ω  [R0402]  37.12 47.51 270 bottom
R4  5.1kΩ  [R0402]  23.47 38.48 90 bottom
SW1  TS-1088-AR02016  [SW-SMD_L3.9-W3.0-P4.45]  33.33 47.94 180 bottom
SW2  TS-1088-AR02016  [SW-SMD_L3.9-W3.0-P4.45]  25.33 47.94 0 bottom
U1  CH340G  [SOIC-16_L9.9-W3.9-P1.27-LS6.0-BL]  42.4 39.94 0 bottom
U2  ATMEGA328P-MU  [HVQFN-32_L5.0-W5.0-P0.50-TL-EP3.1]  29.33 39.94 90 bottom
U3  16MHz  [CRYSTAL-SMD_4P-L3.2-W2.5-BL_SIT8008BI]  23.26 34.38 180 bottom
USBC1  TYPE-C-31-M-12  [USB-C_SMD-TYPE-C-31-M-12]  54.97 31.59 270 bottom
X1  12MHz  [CRYSTAL-SMD_3P-L3.2-W1.3-P1.20-L-1]  46.21 45.08 180 bottom

## Footprints (pads in the part's own frame, mm; a bottom-side part is the same pattern mirrored in y, then rotated)
BUZ-SMD_L5.0-W5.5-P4.60
  rect 1.7x0.7 smd: 1(-2.3,-1.75) 2(2.3,-1.75) 3(-2.3,1.75)
C0402
  rect 0.79x0.54 smd: 1(-0.545,0) 2(0.545,0)
CRYSTAL-SMD_3P-L3.2-W1.3-P1.20-L-1
  rect 0.5x1.5 smd: 1(-1.2,0) 2(0,0) 3(1.2,0)
CRYSTAL-SMD_4P-L3.2-W2.5-BL_SIT8008BI
  rect 1.4x1.2 smd: 1(-1.1,-0.85) 2(1.1,-0.85) 3(1.1,0.85) 4(-1.1,0.85)
HDR-TH_6P-P2.54-V-F
  round 1.8 smd: 1(-6.35,0)
  round 1.6 smd: 2(-3.81,0) 3(-1.27,0) 4(1.27,0) 5(3.81,0) 6(6.35,0)
HVQFN-32_L5.0-W5.0-P0.50-TL-EP3.1
  rect 0.665x0.28 smd: 1(-2.408,1.75) 2(-2.408,1.25) 3(-2.408,0.75) 4(-2.408,0.25) 5(-2.408,-0.25) 6(-2.408,-0.75) 7(-2.408,-1.25) 8(-2.408,-1.75) 17(2.408,-1.75) 18(2.408,-1.25) 19(2.408,-0.75) 20(2.408,-0.25) 21(2.408,0.25) 22(2.408,0.75) 23(2.408,1.25) 24(2.408,1.75)
  rect 0.28x0.665 smd: 9(-1.75,-2.408) 10(-1.25,-2.408) 11(-0.75,-2.408) 12(-0.25,-2.408) 13(0.25,-2.408) 14(0.75,-2.408) 15(1.25,-2.408) 16(1.75,-2.408) 25(1.75,2.408) 26(1.25,2.408) 27(0.75,2.408) 28(0.25,2.408) 29(-0.25,2.408) 30(-0.75,2.408) 31(-1.25,2.408) 32(-1.75,2.408)
  rect 3.1x3.1 smd: 33(0,0)
LED-SMD_4P-L2.0-W2.0-TL_WS2812B-2020
  rect 0.9x0.7 smd: 1(-0.915,0.55) 2(-0.915,-0.55) 3(0.915,-0.55) 4(0.915,0.55)
R0402
  rect 0.566x0.54 smd: 1(-0.433,0) 2(0.433,0)
SOIC-16_L9.9-W3.9-P1.27-LS6.0-BL
  oval 0.602x1.971 smd: 1(-4.445,-2.736) 2(-3.175,-2.736) 3(-1.905,-2.736) 4(-0.635,-2.736) 5(0.635,-2.736) 6(1.905,-2.736) 7(3.175,-2.736) 8(4.445,-2.736) 9(4.445,2.736) 10(3.175,2.736) 11(1.905,2.736) 12(0.635,2.736) 13(-0.635,2.736) 14(-1.905,2.736) 15(-3.175,2.736) 16(-4.445,2.736)
SOT-23-3_L2.9-W1.6-P1.90-LS2.8-BR
  rect 1.07x0.6 smd: 1(1.235,-0.95) 2(1.235,0.95) 3(-1.235,0)
SW-SMD_L3.9-W3.0-P4.45
  rect 1.23x1.36 smd: 1(-2.185,0) 2(2.185,0)
USB-C_SMD-TYPE-C-31-M-12
  oval 1.2x2 hole 0.8x1.6: 0(-4.325,1.706) 1(4.325,1.706)
  oval 1.2x1.8 hole 0.8x1.4: 2(4.325,-2.474) 3(-4.325,-2.474)
  rect 0.3x1.3 smd: A1(-3.35,2.474) A4(-2.55,2.474) A5(-1.25,2.474) A6(-0.25,2.474) A7(0.25,2.474) A8(1.25,2.474) A9(2.55,2.474) A12(3.35,2.474) B1(3.05,2.474) B4(2.25,2.474) B5(1.75,2.474) B6(0.75,2.474) B7(-0.75,2.474) B8(-1.75,2.474) B9(-2.25,2.474) B12(-3.05,2.474)

## Nets
As in the schematic.

Pads without a net: BUZZER1 3; LED2 1; U1 9 10 11 12 14 15; U2 1 2 12 13 14 19 20 22 23 24 25 26 27 28 32; USBC1 A8 B8

## Text on the board
Bottom Silkscreen Layer: VCC | GND | SCK | MISO | MOSI | RESET | START/STOP
